# EAGLE schematic PlacaSubsatélite (EAGLE 9.6.2)
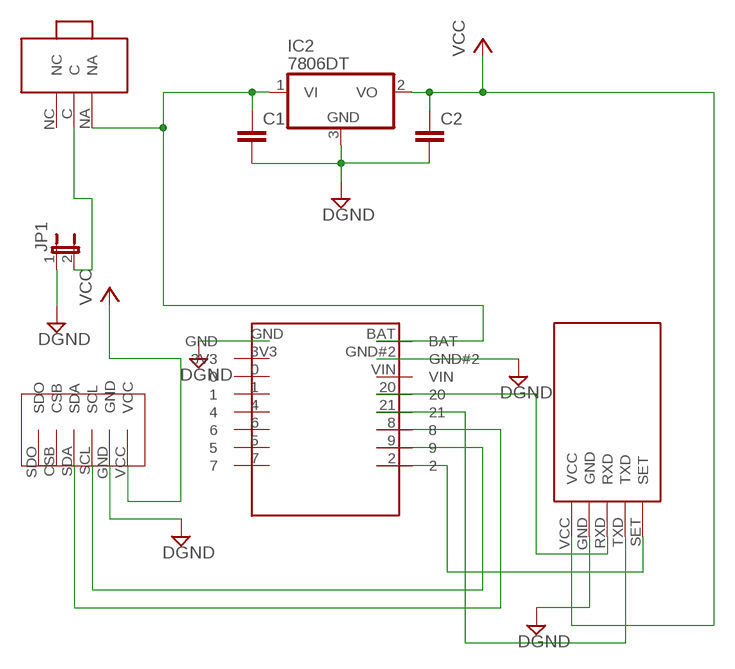
[diagram p0: schematic, sheet 1]

## Parts
C1  C-EUC1210  [C1210]
C2  C-EUC1210  [C1210]
IC2  7806DT  [TO252]
JP1  JP1E  [JP1]
U$1  BMP280  [BMP280]
U$2  MODULO_RADIO  [MÓDULO_RADIO]
U$3  ESP32  [ESP32]
U$4  SWITCH  [SWITCH]

## Nets
DGND: C1.2 C2.2 IC2.3(GND) JP1.1 U$1.GND U$2.GND U$3.GND U$3.GND#2
N$1: C1.1 IC2.1(VI) U$3.BAT U$4.NA
N$2: JP1.2 U$4.C
N$3: U$1.SDA U$3.8
N$4: U$1.SCL U$3.9
N$5: U$2.SET U$3.2
N$6: U$2.RXD U$3.20
N$7: U$2.TXD U$3.21
N$11: U$1.CSB U$1.SDO
VCC: C2.1 IC2.2(VO) U$1.VCC U$2.VCC
Unconnected: U$3.0 U$3.1 U$3.3V3 U$3.4 U$3.5 U$3.6 U$3.7 U$3.VIN U$4.NC

## Library data of the parts
C1 C2 = rcl:C-EU: CAPACITOR, European symbol; SPICEPREFIX: C
IC2 = linear:78*: Positive VOLTAGE REGULATOR Source: http://cache.national.com/ds/LM/LM78L05.pdf http://www.fairchildsemi.com/ds/LM/LM7805.pdf
JP1 = jumper:JP1E: JUMPER
U$1 = BMP280:BMP280
U$2 = MóduloRadio:MODULO_RADIO
U$3 = ESP32:ESP32
U$4 = switch:SWITCH